# Altium schematic sheet AS_Node_Transceiver.SchDoc
size A4
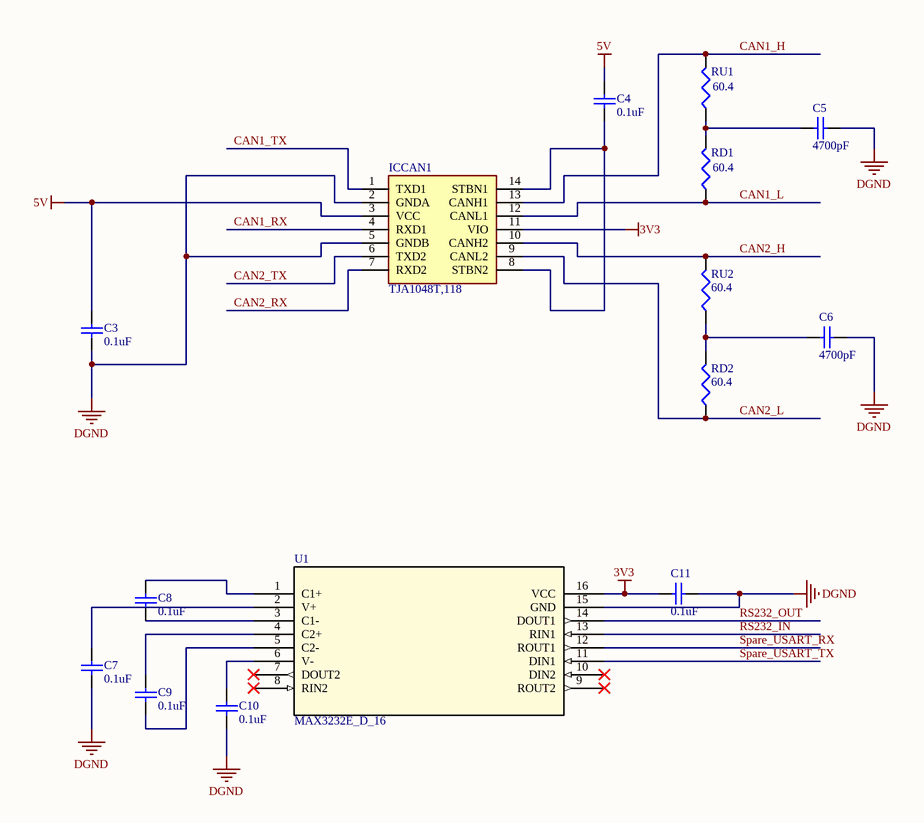
[diagram p0: AS_Node_Transceiver.SchDoc]

## Parts
C3  value 0.1uF  [SMD-0805C]  (hidden comment: Cap Semi)
C4  value 0.1uF  [SMD-0805C]  (hidden comment: Cap Semi)
C5  value 4700pF  [SMD-0805C]  (hidden comment: Cap Semi)
C6  value 4700pF  [SMD-0805C]  (hidden comment: Cap Semi)
C7  value 0.1uF  [SMD-0805C]  (hidden comment: Cap Semi)
C8  value 0.1uF  [SMD-0805C]  (hidden comment: Cap Semi)
C9  value 0.1uF  [SMD-0805C]  (hidden comment: Cap Semi)
C10  value 0.1uF  [SMD-0805C]  (hidden comment: Cap Semi)
C11  value 0.1uF  [SMD-0805C]  (hidden comment: Cap Semi)
ICCAN1  TJA1048T,118  [SOIC127P600X175-14N]
RD1  value 60.4  [SMD-0805-RES]  (hidden comment: Res3)
RD2  value 60.4  [SMD-0805-RES]  (hidden comment: Res3)
RU1  value 60.4  [SMD-0805-RES]  (hidden comment: Res3)
RU2  value 60.4  [SMD-0805-RES]  (hidden comment: Res3)
U1  MAX3232E_D_16  [D16]

## Nets
3V3: C11.1 ICCAN1.11(VIO) U1.16(VCC)
5V: C3.1 C4.1 ICCAN1.3(VCC)
DGND: C3.2 C5.2 C6.2 C7.2 C10.2 C11.2 ICCAN1.2(GNDA) ICCAN1.5(GNDB) U1.15(GND)
CAN1_H: ICCAN1.13(CANH1) RU1.2
CAN1_L: ICCAN1.12(CANL1) RD1.1
CAN1_RX: ICCAN1.4(RXD1)
CAN1_TX: ICCAN1.1(TXD1)
CAN2_H: ICCAN1.10(CANH2) RU2.2
CAN2_L: ICCAN1.9(CANL2) RD2.1
CAN2_RX: ICCAN1.7(RXD2)
CAN2_TX: ICCAN1.6(TXD2)
RS232_IN: U1.13(RIN1)
RS232_OUT: U1.14(DOUT1)
Spare_USART_RX: U1.12(ROUT1)
Spare_USART_TX: U1.11(DIN1)
NetC4_2: C4.2 ICCAN1.8(STBN2) ICCAN1.14(STBN1)
NetC5_1: C5.1 RD1.2 RU1.1
NetC6_1: C6.1 RD2.2 RU2.1
NetC7_1: C7.1 U1.2(V+)
NetC8_1: C8.1 U1.1(C1+)
NetC8_2: C8.2 U1.3(C1-)
NetC9_1: C9.1 U1.4(C2+)
NetC9_2: C9.2 U1.5(C2-)
NetC10_1: C10.1 U1.6(V-)

Not connected (* = marked no-connect by the designer): U1 7(DOUT2)* 8(RIN2)* 9(ROUT2)* 10(DIN2)*

## Library data of the parts
C3-C11 = Cap Semi: Capacitor (Semiconductor SIM Model); Published: 8-Jun-2000; LatestRevisionDate: 29-May-2009; LatestRevisionNote: IPC-7351 Footprint Added.; PackageReference: C1206; Publisher: Altium Limited; PackageDescription: Chip Capacitor
ICCAN1 = TJA1048T,118: Integrated Circuit; Manufacturer_Name: Nexperia; Datasheet Link: https://www.nxp.com/docs/en/data-sheet/TJA1048.pdf; Height: 1.75mm; Manufacturer_Part_Number: TJA1048T,118; Mouser Part Number: 771-TJA1048T118; Mouser Price/Stock: https://www.mouser.com/Search/Refine.aspx?Keyword=771-TJA1048T118
RD1 RD2 RU1 RU2 = Res3: Resistor; Published: 8-Jun-2000; LatestRevisionDate: 29-May-2009; LatestRevisionNote: IPC-7351 Footprint Added.; PackageReference: J1-0603; Publisher: Altium Limited; PackageDescription: Chip Resistor
U1 = MAX3232E_D_16: Imported; Manufacturer: Texas Instruments; INDUSTRY_STD_PKG_TYPE: SOIC; FAMILY_NAME: RS-232; PIN_COUNT: 16; PACKAGE_DESIGNATOR: D; Datasheet_URL: http://www.ti.com/lit/gpn/MAX3232E; GENERIC_PART_NUMBER: MAX3232E; Vendor: Texas Instruments; Manufacturer_Part_Number: max3232e_d_16; Value: Value; Type: Type; RefDes: RefDes